# Altium schematic sheet Preamp_Section.SchDoc
size A3
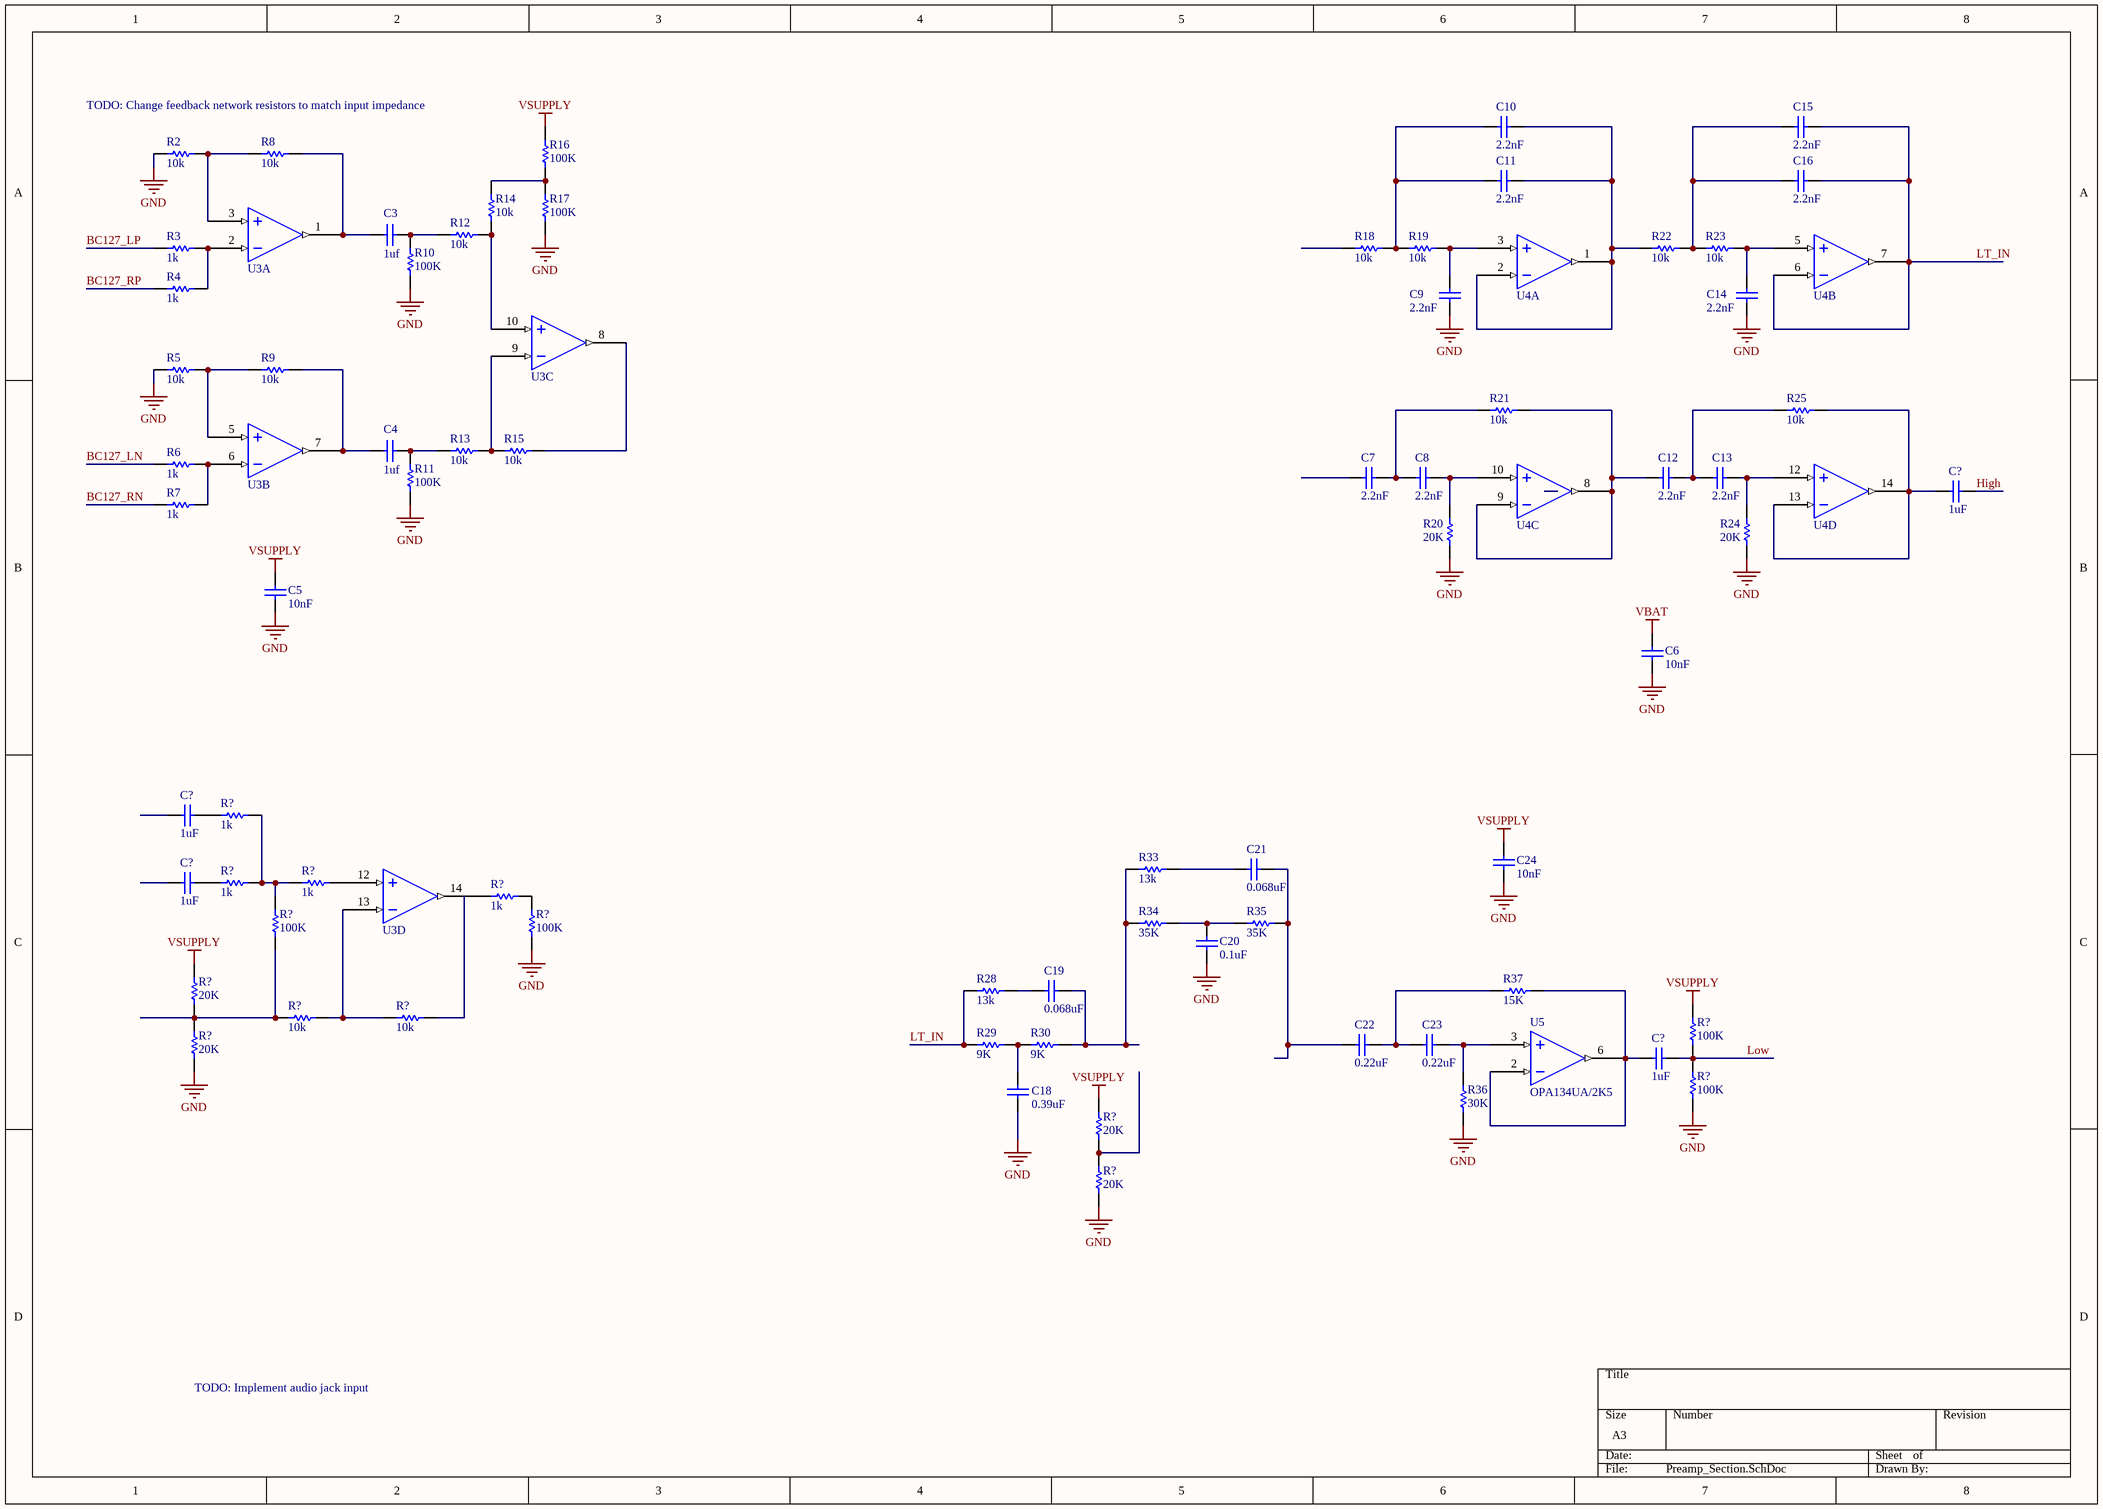
[diagram p0: Preamp_Section.SchDoc]

## Parts
(Parts that share a designator on the sheet are numbered #1, #2 ... from top to bottom, then left to right.)
C3  1uf
C4  1uf
C5  10nF  [CAPC1608X09N]
C6  10nF  [CAPC1608X09N]
C7  2.2nF  [CAPC1608X09N]
C8  2.2nF  [CAPC1608X09N]
C9  2.2nF  [CAPC1608X09N]
C10  2.2nF  [CAPC1608X09N]
C11  2.2nF  [CAPC1608X09N]
C12  2.2nF  [CAPC1608X09N]
C13  2.2nF  [CAPC1608X09N]
C14  2.2nF  [CAPC1608X09N]
C15  2.2nF  [CAPC1608X09N]
C16  2.2nF  [CAPC1608X09N]
C18  0.39uF
C19  0.068uF  [CAP1913]
C20  0.1uF  [CAP1913]
C21  0.068uF  [CAP1913]
C22  0.22uF  [CAP FILM 1UF RADIAL 5MM]
C23  0.22uF  [CAP FILM 1UF RADIAL 5MM]
C24  10nF  [CAPC1608X09N]
C?#1  1uF  [CAP Radial 5mm]
C?#2  1uF  [CAP Radial 5mm]
C?#3  1uF  [CAP Radial 5mm]
C?#4  1uF  [CAP Radial 5mm]
R2  10k  [RESC1608X06N]
R3  1k  [RESC1608X06N]
R4  1k  [RESC1608X06N]
R5  10k  [RESC1608X06N]
R6  1k  [RESC1608X06N]
R7  1k  [RESC1608X06N]
R8  10k  [RESC1608X06N]
R9  10k  [RESC1608X06N]
R10  100K  [RESC1608X06N]
R11  100K  [RESC1608X06N]
R12  10k  [RESC1608X06N]
R13  10k  [RESC1608X06N]
R14  10k  [RESC1608X06N]
R15  10k  [RESC1608X06N]
R16  100K  [RESC1608X06N]
R17  100K  [RESC1608X06N]
R18  10k  [RESC1608X06N]
R19  10k  [RESC1608X06N]
R20  20K  [RESC1608X06N]
R21  10k  [RESC1608X06N]
R22  10k  [RESC1608X06N]
R23  10k  [RESC1608X06N]
R24  20K  [RESC1608X06N]
R25  10k  [RESC1608X06N]
R28  13k  [RESC1608X06N]
R29  9K  [RESC1608X06N]
R30  9K  [RESC1608X06N]
R33  13k  [RESC1608X06N]
R34  35K  [RESC1608X06N]
R35  35K  [RESC1608X06N]
R36  30K  [RESC1608X06N]
R37  15K  [RESC1608X06N]
R?#1  1k  [RESC1608X06N]
R?#2  1k  [RESC1608X06N]
R?#3  1k  [RESC1608X06N]
R?#4  1k  [RESC1608X06N]
R?#5  100K  [RESC1608X06N]
R?#6  100K  [RESC1608X06N]
R?#7  20K  [RESC1608X06N]
R?#8  10k  [RESC1608X06N]
R?#9  10k  [RESC1608X06N]
R?#10  100K  [RESC1608X06N]
R?#11  20K  [RESC1608X06N]
R?#12  100K  [RESC1608X06N]
R?#13  20K  [RESC1608X06N]
R?#14  20K  [RESC1608X06N]
U3  OPA4134UA  [SOIC127P600X175-14N]  (value not drawn)  (parts A,B,C,D of 4)
U4  OPA4134UA  [SOIC127P600X175-14N]  (value not drawn)  (parts A,B,C,D of 4)
U5  OPA134UA/2K5  [SOIC127P600X175-8N]

## Nets
GND: C5.1 C6.1 C9.1 C14.1 C18.1 C20.2 C24.1 R2.1 R5.1 R10.1 R11.1 R17.1 R20.1 R24.2 R36.1 R?#6.1 R?#11.1 R?#12.1 R?#14.1 U3.11(V-) U4.11(V-) U5.4(V-)
VBAT: C6.2 U5.7(V+)
VSUPPLY: C5.2 C24.2 R16.2 R?#7.2 R?#10.2 R?#13.2 U3.4(V+) U4.4(V+)
BC127_LN: R6.1
BC127_LP: R3.1
BC127_RN: R7.1
BC127_RP: R4.1
High: C?#1.2
Low: C?#4.2 R?#10.1 R?#12.2
LT_IN: C15.2 C16.2 R28.1 R29.1 U4.6(-In_B) U4.7(Out_B)
NetC3_1: C3.1 R8.2 U3.1(Out_A)
NetC3_2: C3.2 R10.2 R12.1
NetC4_1: C4.1 R9.2 U3.7(Out_B)
NetC4_2: C4.2 R11.2 R13.1
NetC7_2: C7.2 C8.1 R21.1
NetC8_2: C8.2 R20.2 U4.10(+In_C)
NetC9_2: C9.2 R19.2 U4.3(+In_A)
NetC10_1: C10.1 C11.1 R18.2 R19.1
NetC10_2: C10.2 C11.2 R22.1 U4.1(Out_A) U4.2(-In_A)
NetC12_1: C12.1 R21.2 U4.8(Out_C) U4.9(-In_C)
NetC12_2: C12.2 C13.1 R25.1
NetC13_2: C13.2 R24.1 U4.12(+In_D)
NetC14_2: C14.2 R23.2 U4.5(+In_B)
NetC15_1: C15.1 C16.1 R22.2 R23.1
NetC18_2: C18.2 R29.2 R30.1
NetC19_1: C19.1 R28.2
NetC19_2: C19.2 R30.2 R33.1 R34.1
NetC20_1: C20.1 R34.2 R35.1
NetC21_1: C21.1 R33.2
NetC21_2: C21.2 C22.1 R35.2
NetC22_2: C22.2 C23.1 R37.1
NetC23_2: C23.2 R36.2 U5.3(+In_A)
NetC?#1_1: C?#1.1 R25.2 U4.13(-In_D) U4.14(Out_D)
NetC?#2_2: C?#2.2 R?#1.1
NetC?#3_2: C?#3.2 R?#2.1
NetC?#4_1: C?#4.1 R37.2 U5.2(-In_A) U5.6(Out)
NetR2_2: R2.2 R8.1 U3.3(+In_A)
NetR3_2: R3.2 R4.2 U3.2(-In_A)
NetR5_2: R5.2 R9.1 U3.5(+In_B)
NetR6_2: R6.2 R7.2 U3.6(-In_B)
NetR12_2: R12.2 R14.1 U3.10(+In_C)
NetR13_2: R13.2 R15.2 U3.9(-In_C)
NetR14_2: R14.2 R16.1 R17.2
NetR15_1: R15.1 U3.8(Out_C)
NetR?#1_2: R?#1.2 R?#2.2 R?#3.1 R?#5.2
NetR?#3_2: R?#3.2 U3.12(+In_D)
NetR?#4_1: R?#4.1 U3.14(Out_D)
NetR?#4_2: R?#4.2 R?#6.2
NetR?#5_1: R?#5.1 R?#7.1 R?#8.1 R?#11.2
NetR?#8_2: R?#8.2 R?#9.1 U3.13(-In_D)
NetR?#13_1: R?#13.1 R?#14.2

Not connected (* = marked no-connect by the designer): C7 1; C?#2 1; C?#3 1; R18 1; R?#9 2

## Notes on the sheet
- TODO: Change feedback network resistors to match input impedance
- TODO: Implement audio jack input

## Library data of the parts
C3 C4 = CAP Radial 5mm: Manufacturer: EPCOS (TDK); Manufacturer P/N: B32529C105J; Voltage: 63V; Value: 1uf; Digikey Part Number: 495-1119-ND
C5 C6 C24 = Capacitor 10nF 0603: Capacitor 2.2nF 0805; Value: 10nF; Digikey Part Number: 311-1085-1-ND
C7-C16 = CAP 2.2nF 0603: Capacitor 2.2nF 0603; Value: 2.2nF; Digikey Part Number: PCF1300CT-ND
C18 = CAP 0.39uF Radial 5mm: Manufacturer: EPCOS (TDK); Manufacturer P/N: B32529C105J; Voltage: 63V; Value: 0.39uF; Digikey Part Number: 495-4846-1-ND
C19 C21 = Capacitor 0.068uF 1913: Value: 0.068uF; Digikey Part Number: PCF1550CT-ND
C20 = Capacitor 0.1uF 1913: Value: 0.1uF; Digikey Part Number: PCF1552CT-ND
C22 C23 = CAP 0.22uF Radial 5mm: Manufacturer: EPCOS (TDK); Voltage: 100V; Value: 0.22uF; Digikey Part Number: 495-4985-1-ND
C?#1-C?#4 = CAP 1uF Radial 5mm: Manufacturer: EPCOS (TDK); Manufacturer P/N: B32529C105J; Voltage: 63V; Value: 1uF; Digikey Part Number: 495-1119-ND
R2 R5 R8 R9 R12-R15 R18 R19 R21-R23 R25 R?#8 R?#9 = RES 10K 0603: Manufacturer: Yageo; Manufacturer Part Number: RC0603FR-0710KL; Tolerance: 1%; Power: 0.1W; Type: RES; Footprint: 0603; Temperature: 155dC; Digikey Part Number: 311-10.0KHRCT-ND; Value: 10k
R3 R4 R6 R7 R?#1-R?#4 = RES 1K 0603: Manufacturer: Panasonic; Manufacturer Part Number: ERJ-PA3F1001V; Tolerance: 1%; Power: 0.25W; Type: RES; Footprint: 0603; Temperature: 155dC; Digikey Part Number: P1.0KBYCT-ND; Value: 1k
R10 R11 R16 R17 R?#5 R?#6 R?#10 R?#12 = RES 100K 0603: Tolerance: 1%; Power: 0.1W; Footprint: 0603; Value: 100K
R20 R24 R?#7 R?#11 R?#13 R?#14 = RES 20K 0603: Tolerance: 1%; Power: 0.1W; Footprint: 0603; Value: 20K
R28 R33 = RES 13K 0603: Tolerance: 1%; Type: RES; Footprint: 0603; Value: 13k
R29 R30 = RES 9K 0603: Tolerance: 1%; Type: RES; Footprint: 0603; Value: 9K
R34 R35 = RES 35K 0603: Tolerance: 1%; Type: RES; Footprint: 0603; Value: 35K
R36 = RES 30K 0603: Tolerance: 1%; Type: RES; Footprint: 0603; Value: 30K
R37 = RES 15K 0306: Tolerance: 1%; Type: RES; Footprint: 0603; Value: 15K
U3 U4 = OPA4134UA: Quad OPAx134 Operational Amplifier
U5 = OPA134UA/2K5: Digikey Part Number: 296-26241-1-ND